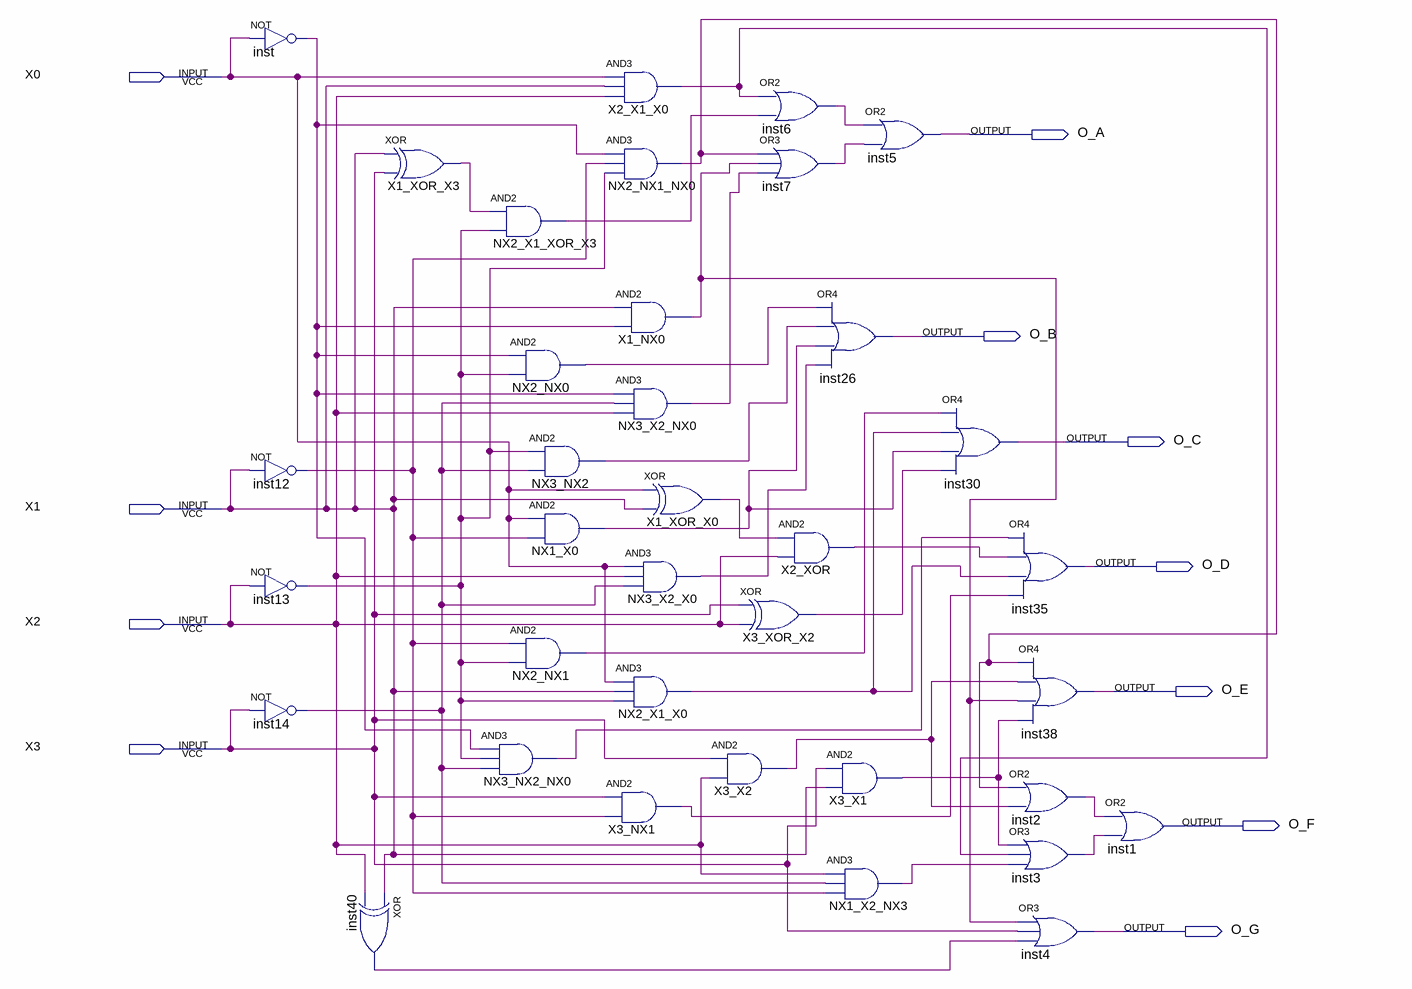
[diagram p0: schematic sheet]
// Quartus schematic lab3_DC.bdf as structural Verilog: 36 symbols, 11 pins
module lab3_DC (
  input  X0,
  input  X1,
  input  X2,
  input  X3,
  output O_A,
  output O_B,
  output O_C,
  output O_D,
  output O_E,
  output O_F,
  output O_G
);

  wire inst2_out, inst3_out, inst6_out, inst7_out, inst12_out, inst13_out, inst14_out, inst40_out, inst_out,
       NX1_X0_out, NX1_X2_NX3_out, NX2_NX0_out, NX2_NX1_NX0_out, NX2_NX1_out, NX2_X1_X0_out,
       NX2_X1_XOR_X3_out, NX3_NX2_NX0_out, NX3_NX2_out, NX3_X2_NX0_out, NX3_X2_X0_out, X1_NX0_out,
       X1_XOR_X0_out, X1_XOR_X3_out, X2_X1_X0_out, X2_XOR_out, X3_NX1_out, X3_X1_out, X3_X2_out,
       X3_XOR_X2_out;

  not inst (inst_out, X0);
  not inst12 (inst12_out, X1);
  not inst13 (inst13_out, X2);
  not inst14 (inst14_out, X3);
  xor inst40 (inst40_out, X1, X2);
  xor X1_XOR_X3 (X1_XOR_X3_out, X1, X3);
  and NX2_X1_XOR_X3 (NX2_X1_XOR_X3_out, X1_XOR_X3_out, inst13_out);
  and NX3_NX2_NX0 (NX3_NX2_NX0_out, inst_out, inst13_out, inst14_out);
  and NX2_NX0 (NX2_NX0_out, inst_out, inst13_out);
  and NX3_NX2 (NX3_NX2_out, inst13_out, inst14_out);
  and NX1_X0 (NX1_X0_out, X0, inst12_out);
  and NX2_NX1 (NX2_NX1_out, inst12_out, inst13_out);
  and X2_X1_X0 (X2_X1_X0_out, X0, X1, X2);
  and NX2_NX1_NX0 (NX2_NX1_NX0_out, inst_out, inst12_out, inst13_out);
  and X1_NX0 (X1_NX0_out, X1, inst_out);
  and NX3_X2_NX0 (NX3_X2_NX0_out, inst_out, inst14_out, X2);
  xor X1_XOR_X0 (X1_XOR_X0_out, X0, X1);
  and NX3_X2_X0 (NX3_X2_X0_out, X0, X2, inst14_out);
  and NX2_X1_X0 (NX2_X1_X0_out, X0, X1, inst13_out);
  and X3_NX1 (X3_NX1_out, X3, inst12_out);
  and X3_X2 (X3_X2_out, X3, X2);
  or inst6 (inst6_out, X2_X1_X0_out, NX2_X1_XOR_X3_out);
  or inst7 (inst7_out, NX2_NX1_NX0_out, X1_NX0_out, NX3_X2_NX0_out);
  and X2_XOR (X2_XOR_out, X1_XOR_X0_out, X2);
  xor X3_XOR_X2 (X3_XOR_X2_out, X3, X2);
  or inst5 (O_A, inst6_out, inst7_out);
  or inst26 (O_B, NX2_NX0_out, NX3_NX2_out, NX1_X0_out, NX3_X2_X0_out);
  and X3_X1 (X3_X1_out, X3, X1);
  and NX1_X2_NX3 (NX1_X2_NX3_out, X2, inst14_out, inst12_out);
  or inst30 (O_C, NX2_NX1_out, NX2_X1_X0_out, NX1_X0_out, X3_XOR_X2_out);
  or inst35 (O_D, NX3_NX2_NX0_out, X2_XOR_out, NX2_X1_X0_out, X3_NX1_out);
  or inst38 (O_E, NX2_NX1_NX0_out, X3_X2_out, X1_NX0_out, X3_X1_out);
  or inst2 (inst2_out, NX2_NX1_NX0_out, X3_X2_out);
  or inst3 (inst3_out, X3_X1_out, X2_X1_X0_out, NX1_X2_NX3_out);
  or inst4 (O_G, X1_NX0_out, X3, inst40_out);
  or inst1 (O_F, inst2_out, inst3_out);
endmodule
